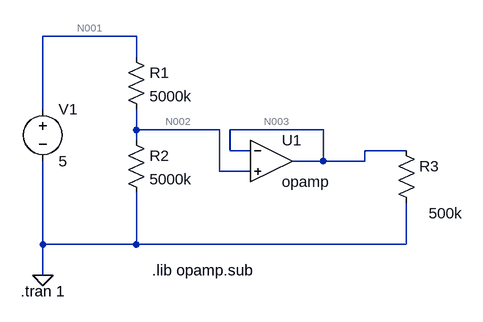
[diagram p0: schematic T4_2_opamp.asc]
T4_2_opamp.asc, the LTspice schematic file:
Version 4
SHEET 1 984 680
WIRE 240 16 96 16
WIRE 240 48 240 16
WIRE 96 128 96 16
WIRE 240 160 240 128
WIRE 368 160 240 160
WIRE 528 160 384 160
WIRE 240 176 240 160
WIRE 384 192 384 160
WIRE 416 192 384 192
WIRE 656 192 592 192
WIRE 528 208 528 160
WIRE 528 208 480 208
WIRE 592 208 592 192
WIRE 592 208 528 208
WIRE 368 224 368 160
WIRE 416 224 368 224
WIRE 96 336 96 208
WIRE 240 336 240 256
WIRE 240 336 96 336
WIRE 656 336 656 272
WIRE 656 336 240 336
WIRE 96 384 96 336
FLAG 96 384 0
SYMBOL voltage 96 112 R0
WINDOW 123 0 0 Left 0
WINDOW 39 0 0 Left 0
SYMATTR InstName V1
SYMATTR Value 5
SYMBOL res 224 32 R0
SYMATTR InstName R1
SYMATTR Value 5000k
SYMBOL res 224 160 R0
SYMATTR InstName R2
SYMATTR Value 5000k
SYMBOL res 640 176 R0
WINDOW 3 50 112 Left 2
SYMATTR InstName R3
SYMATTR Value 500k
SYMBOL OpAmps\\opamp 448 144 R0
SYMATTR InstName U1
TEXT 62 408 Left 2 !.tran 1
TEXT 264 376 Left 2 !.lib opamp.sub

The netlist it stands for:
* T4_2_opamp.asc
V1 N001 0 5
R1 N001 N002 5000k
R2 N002 0 5000k
R3 N003 0 500k
XU1 N003 N002 N003 opamp Aol=100K GBW=10Meg  ; pins invin noninvin out
.tran 1
.lib opamp.sub
.backanno
.end

* Results of the author's LTspice run, read from the files saved beside the schematic
* Operating Point, zero values left out:
*   V(n001) = 5 V
*   V(n002) = 2.5 V
*   V(n003) = 2.5 V
*   I(R3) = 5 µA
*   I(R2) = 500 nA
*   I(R1) = 500 nA
*   I(V1) = -500 nA
*   Ix(u1:3) = -5 µA